# EAGLE schematic Schematic_PCB (EAGLE 6.5.0)
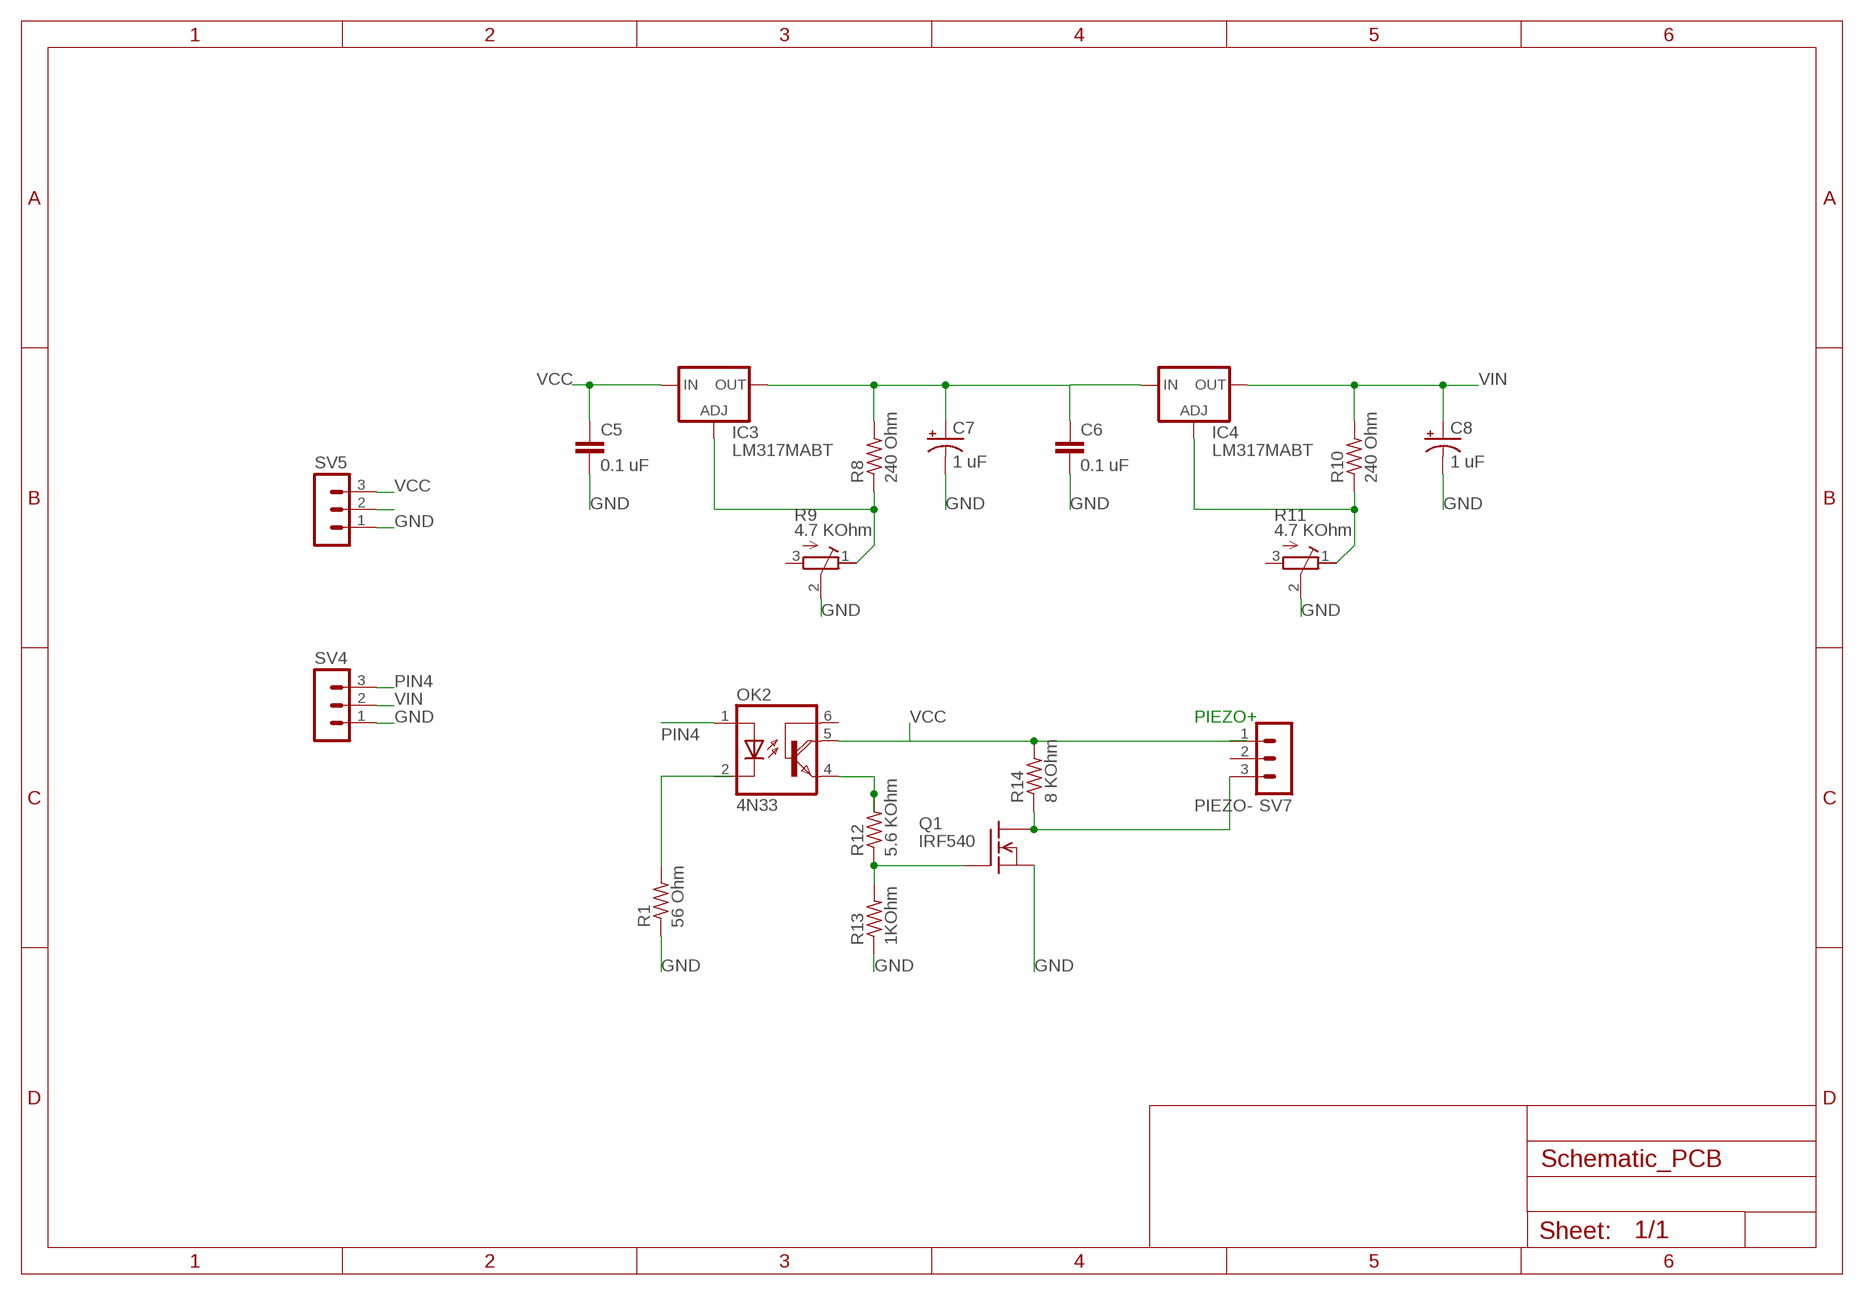
[diagram p0: schematic, sheet 1]

## Parts
C5  0.1 uF  C2.5/2  [C2.5-2]
C6  0.1 uF  C2.5/2  [C2.5-2]
C7  1 uF  CPOL-USB45181C  [B45181C]
C8  1 uF  CPOL-USB45181C  [B45181C]
IC3  LM317MABT  [TO220L1]
IC4  LM317MABT  [TO220L1]
OK2  4N33  [DIL06]
Q1  IRF540  [TO220]
R1  56 Ohm  R-US_0204/5  [0204/5]
R8  240 Ohm  R-US_0204/5  [0204/5]
R9  4.7 KOhm  R-TRIMM43P  [RTRIM43P]
R10  240 Ohm  R-US_0204/5  [0204/5]
R11  4.7 KOhm  R-TRIMM43P  [RTRIM43P]
R12  5.6 KOhm  R-US_0204/5  [0204/5]
R13  1KOhm  R-US_0204/5  [0204/5]
R14  8 KOhm  R-US_0204/5  [0204/5]
SV4  MA03-1  [MA03-1]
SV5  MA03-1  [MA03-1]
SV7  MA03-1  [MA03-1]

## Nets
GND: C5.2 C6.2 C7.- C8.- Q1.3(S) R1.1 R9.2(S) R11.2(S) R13.1 SV4.1 SV5.1
N$1: R1.2
N$3: OK2.4(E) R12.2
N$10: SV5.2
N$11: C7.+ IC3.2(OUT) R8.2
N$12: IC4.1(ADJ) R10.1 R11.1(E)
N$13: IC3.1(ADJ) R8.1 R9.1(E)
N$14: Q1.1(G) R12.1 R13.2
PIEZO-: Q1.2(D) R14.1 SV7.3
PIN4: OK2.1(A) SV4.3
VCC: C5.1 C6.1 IC3.3(IN) IC4.3(IN) OK2.5(COL) R14.2 SV5.3 SV7.1
VIN: C8.+ IC4.2(OUT) R10.2 SV4.2
Unconnected: OK2.2(C) OK2.6(B) R9.3(A) R11.3(A) SV7.2

## Notes on the sheet
- PIEZO+

## Library data of the parts
C5 C6 = capacitor-wima:C: CAPACITOR naming: grid - package width
C7 C8 = resistor:CPOL-US: POLARIZED CAPACITOR, American symbol
IC3 IC4 = v-reg:LM317?*: 500 mA Adjustable Output Positive Voltage Regulator Source: http://www.onsemi.co.jp .. LM317M-D.PDF
OK2 = optocoupler:4N33: MOTOROLA OPTO COUPLER; MF: VISHAY/TELEFUNKEN; MPN: 4N33; OC_FARNELL: 1469601; OC_NEWARK: 88K1390
Q1 = transistor-fet:IRF540: N-Channel Enhancement MOSFET (HEXFET); 100V; 28A; 0,077Ohm
R1 R8 R10 R12-R14 = resistor:R-US_: RESISTOR, American symbol
R9 R11 = rcl:R-TRIMM: Trimm resistor
SV4 SV5 SV7 = con-lstb:MA03-1: PIN HEADER; OC_FARNELL: unknown; OC_NEWARK: unknown